# Altium schematic sheet power.SchDoc
size A4; SheetNumber: 5; SheetTotal: 5
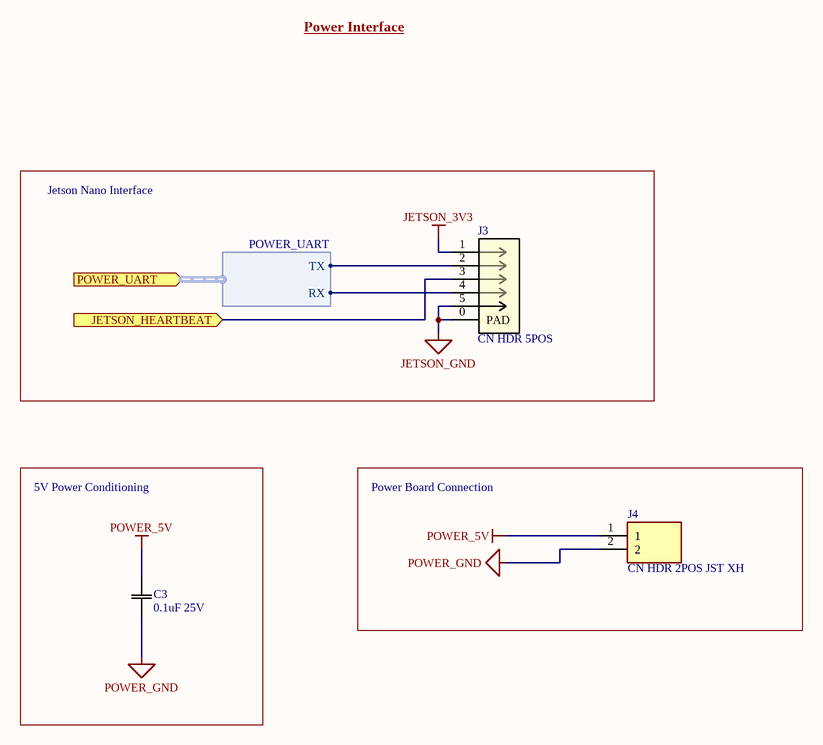
[diagram p0: power.SchDoc]

## Parts
C3  0.1uF 25V  [0805]
J3  CN HDR 5POS  [CN HDR 5POS SMD 1.5MM]
J4  CN HDR 2POS JST XH  [JST_B2B-XH-A(LF)(SN)]

## Blocks framed on the sheet
Jetson Nano Interface: J3
5V Power Conditioning: C3
Power Board Connection: J4

## Ports
JETSON_HEARTBEAT (in), POWER_UART (in, harness POWER_UART)

## Harnesses
POWER_UART: TX, RX

## Nets
JETSON_3V3: J3.1
JETSON_GND: J3.0(PAD) J3.5
POWER_5V: C3.2(C2) J4.1
POWER_GND: C3.1(C1) J4.2
JETSON_HEARTBEAT: J3.3 ; port JETSON_HEARTBEAT
NetJ3_2: J3.2 ; port POWER_UART.TX
NetJ3_4: J3.4 ; port POWER_UART.RX

## Notes on the sheet
- Power Interface

## Library data of the parts
C3 = CAP 0.1uF 25V: Default Symbol for Capacitors; Temperature Coefficient: X7R; Tolerance: 10%; Value: 0.1uF; Rating: 25V; Operating Temperature: -55°C ~ 125°C; Part Number: CAP 0.1uF 25V
J3 = CN HDR 5POS: Connector Header 5 Position; Part Number: CN HDR 5POS; Supplier 1: Digi-Key; Supplier Part Number 1: 455-2383-1-ND; Supplier URL 1: https://www.digikey.ca/en/products/detail/jst-sales-america-inc/BM05B-ZESS-TBT-LF-SN/1886989?s=N4IgTCBcDaICwFYEFowGYAcbkEZkDkAREAXQF8g; Pin Count: 5
J4 = CN HDR 2POS JST XH: Connector Header Through Hole 2 position 0.098 _2.50mm_ / JST XH; MP: B2B-XH-A_LF__SN_; MF: JST Sales; Price: None; Package: None; Value: *; SnapEDA_Link: https://www.snapeda.com/parts/B2B-XH-A%28LF%29%28SN%29/JST%20Sales%20America%20Inc./view-part/492310/?ref=snap; Part Number: CN HDR 2POS JST XH; Pin Count: 2